# Altium project lilfoot.PrjPcb
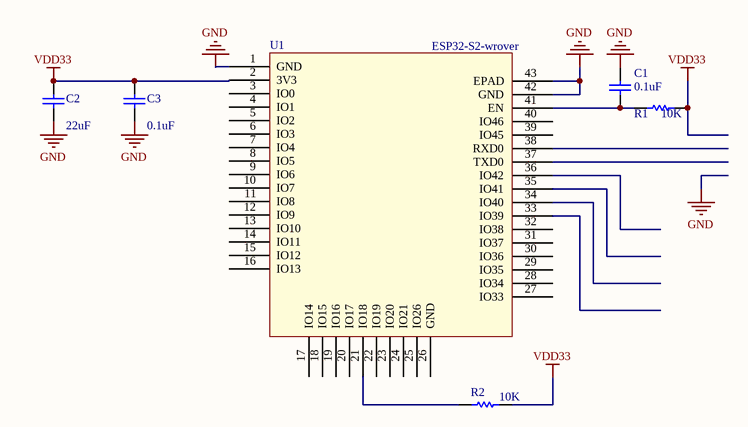
[diagram p0: lilfoot.SchDoc]
2 sheets, 10 parts. Net scope: global (net labels, ports and power ports of the same name join across sheets).
Board file: lilfoot.PcbDoc
Sheets:
  lilfoot.SchDoc
  solarpower.SchDoc

## Sheet lilfoot.SchDoc
size B

### Parts
C1  value 0.1uF  [1608[0603]]  (hidden comment: Cap Semi)
C2  value 22uF  [1608[0603]]  (hidden comment: Cap Semi)
C3  value 0.1uF  [1608[0603]]  (hidden comment: Cap Semi)
R1  value 10K  [1608[0603]]  (hidden comment: Res1)
R2  value 10K  [1608[0603]]  (hidden comment: Res1)
U1  ESP32-S2-wrover

### Nets
GND: C1.1 C2.2 C3.2 U1.1(GND) U1.42(GND) U1.43(EPAD)
VDD33: C2.1 C3.1 R1.2 R2.2 U1.2(3V3)
NetC1_2: C1.2 R1.1 U1.41(EN)
NetR2_1: R2.1 U1.21(IO18)

Not connected (* = marked no-connect by the designer): U1 3(IO0) 4(IO1) 5(IO2) 6(IO3) 7(IO4) 8(IO5) 9(IO6) 10(IO7) 11(IO8) 12(IO9) 13(IO10) 14(IO11) 15(IO12) 16(IO13) 17(IO14) 18(IO15) 19(IO16) 20(IO17) 22(IO19) 23(IO20) 24(IO21) 25(IO26) 26(GND) 27(IO33) 28(IO34) 29(IO35) 30(IO36) 31(IO37) 32(IO38) 33(IO39) 34(IO40) 35(IO41) 36(IO42) 37(TXD0) 38(RXD0) 39(IO45) 40(IO46)

### Library data of the parts
C1-C3 = Cap Semi: Capacitor (Semiconductor SIM Model); Published: 8-Jun-2000; LatestRevisionDate: 29-May-2009; LatestRevisionNote: IPC-7351 Footprint Added.; PackageReference: C1206; Publisher: Altium Limited; PackageDescription: Chip Capacitor
R1 R2 = Res1: Resistor; Published: 8-Jun-2000; LatestRevisionDate: 17-Jul-2002; LatestRevisionNote: Re-released for DXP Platform.; PackageReference: AXIAL-0.3; Publisher: Altium Limited; PackageDescription: Axial Device, Thru-Hole; 2 Leads; 0.3 in Pin Spacing

## Sheet solarpower.SchDoc
size A
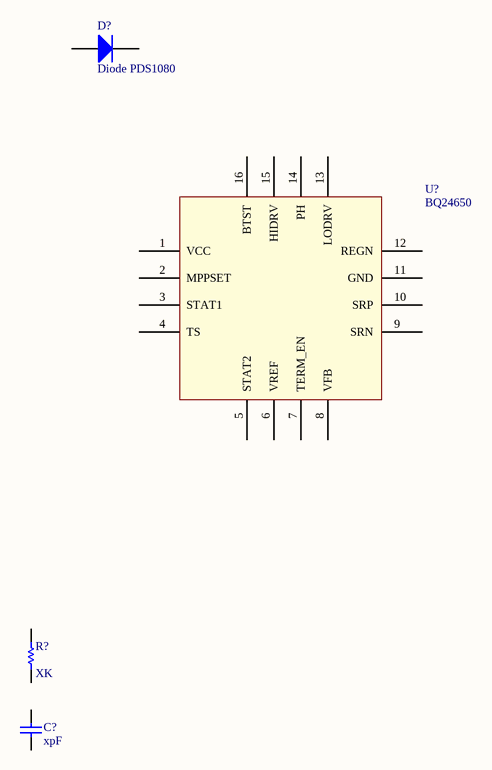
[diagram p1: solarpower.SchDoc]

### Parts
C?  value xpF  [1608[0603]]  (hidden comment: Cap Semi)
D?  Diode PDS1080  [DO-41]
R?  value XK  [1608[0603]]  (hidden comment: Res1)
U?  BQ24650

### Nets

Not connected (* = marked no-connect by the designer): C? 1 2; D? 1(A) 2(K); R? 1 2; U? 1(VCC) 2(MPPSET) 3(STAT1) 4(TS) 5(STAT2) 6(VREF) 7(TERM_EN) 8(VFB) 9(SRN) 10(SRP) 11(GND) 12(REGN) 13(LODRV) 14(PH) 15(HIDRV) 16(BTST)

### Library data of the parts
C? = Cap Semi: Capacitor (Semiconductor SIM Model); Published: 8-Jun-2000; LatestRevisionDate: 29-May-2009; LatestRevisionNote: IPC-7351 Footprint Added.; PackageReference: C1206; Publisher: Altium Limited; PackageDescription: Chip Capacitor
D? = Diode 1N4002: 1 Amp General Purpose Rectifier; Published: 8-Jun-2000; LatestRevisionDate: 17-Jul-2002; LatestRevisionNote: Re-released for DXP Platform.; DatasheetVersion: 1998; PackageVersion: Aug-1999; PackageReference: DO-41; Publisher: Altium Limited; PackageDescription: Diode, Axial; Body 5.2 x 2.7 mm (LxDia. max), Lead Dia. 0.86 mm (max); Code_JEDEC: DO-204-AL; ComponentLink1Description: Manufacturer Link; ComponentLink1URL: http://www.fairchildsemi.com/; ComponentLink2Description: Datasheet; ComponentLink2URL: http://www.fairchildsemi.com/ds/1N%2F1N4001.pdf
R? = Res1: Resistor; Published: 8-Jun-2000; LatestRevisionDate: 17-Jul-2002; LatestRevisionNote: Re-released for DXP Platform.; PackageReference: AXIAL-0.3; Publisher: Altium Limited; PackageDescription: Axial Device, Thru-Hole; 2 Leads; 0.3 in Pin Spacing